# EAGLE design Light_V1.0 (EAGLE 9.4.1)
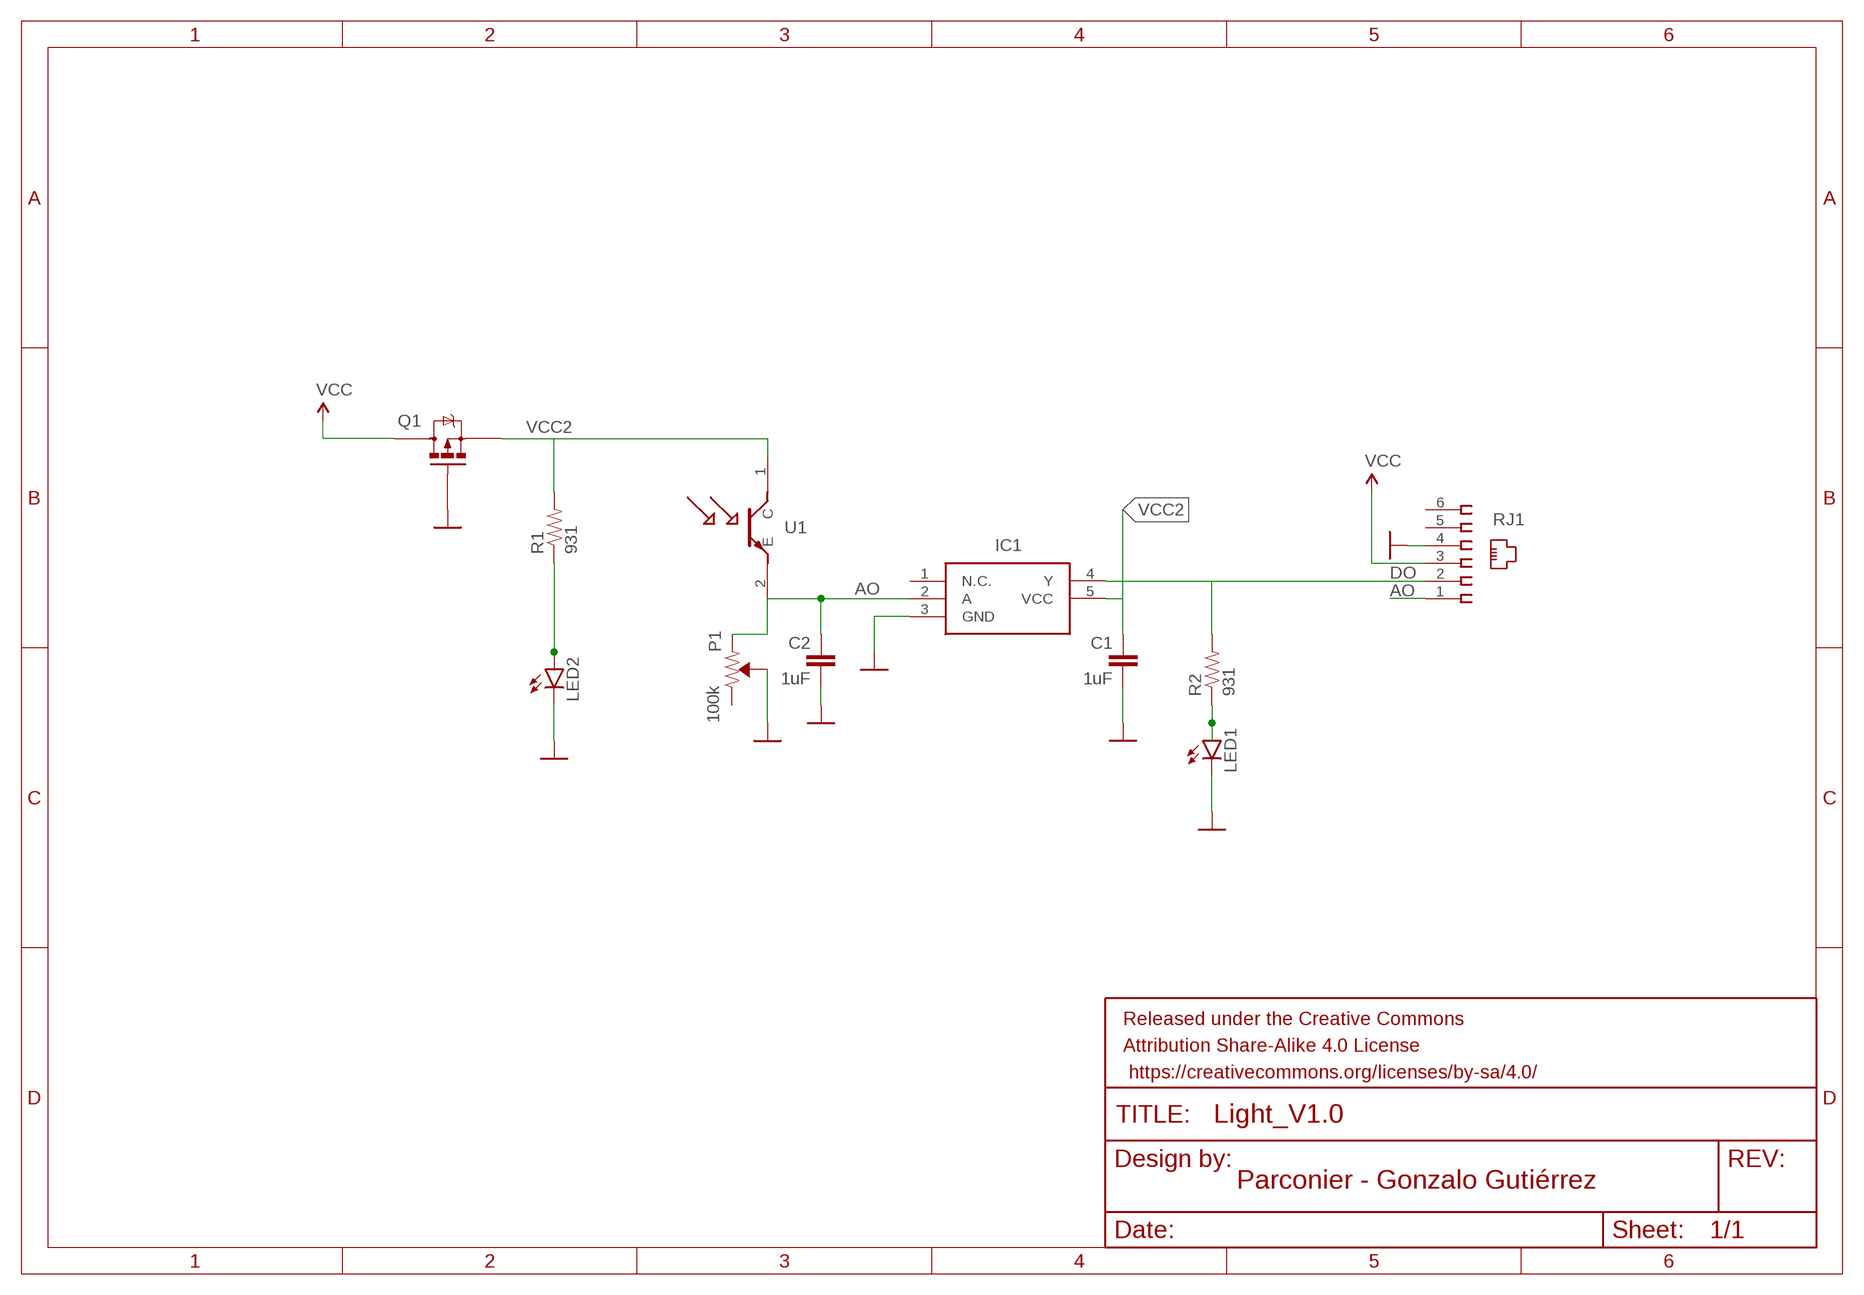
[diagram p0: schematic, sheet 1]

## Parts
C1  1uF  CAP_0402  [0402]
C2  1uF  CAP_0402  [0402]
IC1  74LVC1G14GW-Q100,1  [SOT65P212X110-5N]
LED1  LED0603  [LED-0603]
LED2  LED0603  [LED-0603]
P1  100k  TRIMPOT  [3309W-1-104]
Q1  RU1C002ZPTCL  [SOTFL65P210X105-3N]
R1  931  RES_0402  [RESC1005X35]
R2  931  RES_0402  [RESC1005X35]
RJ1  615006138421  [615006138421]
U1  NJL7302L-F3  [NJL7302L-F3]

## Nets
AO: C2.1 IC1.2(A) P1.1(CCW) RJ1.1 U1.2(E)
DO: IC1.4(Y) R2.2 RJ1.2
GND: C1.2 C2.2 IC1.3(GND) LED1.C LED2.C P1.2(WIPER) Q1.1(G) RJ1.4
N$9: LED1.A R2.1
N$10: LED2.A R1.1
VCC: Q1.3(D) RJ1.3
VCC2: C1.1 IC1.5(VCC) Q1.2(S) R1.2 U1.1(C)
Unconnected: IC1.1(N.C.) P1.3(CW) RJ1.5 RJ1.6

## Library data of the parts
C1 C2 = Perfect_0402:CAP_0402: 0402 (1005 Metric) Nick Garner - TeleSense; MPN: CC0402ZRY5V6BB105
IC1 = 74LVC1G14GW-Q100_1:74LVC1G14GW-Q100,1: Inverter SchmittTrigger CMOS Auto TSSOP5 Source: Datasheet <https://assets.nexperia.com/documents/data-sheet/74LVC1G14_Q100.pdf>; ARROW_PART_NUMBER: 74LVC1G14GW-Q100,1; ARROW_PRICE/STOCK: https://www.arrow.com/en/products/74lvc1g14gw-q1001/nexperia; DESCRIPTION: Inverter SchmittTrigger CMOS Auto TSSOP5; HEIGHT: 1.1mm; MANUFACTURER_NAME: Nexperia; MANUFACTURER_PART_NUMBER: 74LVC1G14GW-Q100,1; MPN: 74AHC1G14GW-Q100,1; RS_PART_NUMBER: 1526474; RS_PRICE/STOCK: http://befr.rs-online.com/web/p/products/1526474
LED1 = SparkFun-LED:LED: LEDs Standard schematic elements and footprints for 5mm, 3mm, 1206, and 0603 sized LEDs. 5mm - Spark Fun Electronics SKU : COM-00529 (and others); MPN: LB Q39E-L2OO-35-1
LED2 = SparkFun-LED:LED: LEDs Standard schematic elements and footprints for 5mm, 3mm, 1206, and 0603 sized LEDs. 5mm - Spark Fun Electronics SKU : COM-00529 (and others); MPN: LTST-C193KRKT-5A
P1 = SparkFun-Resistors_2:TRIMPOT: Trimming Potentiometer (Trimpot) Three-terminal potentiometers, with an adjustable wiper and two adjustable resistors. A pot can be used to create a configurable voltage divider, or as a variable resistor. "Trimpots" are a subset of potentiometers, usually intended for "set-and-forget" applications. They're often more delicate than standard potentiometers - rated for fewer turns. Variants PTH-KNOB - PTH Trimpot w/ finger-adjustable knob Trimpot 10K with Knob <https://www.sparkfun.com/products/9806> (COM-09806) Datasheet <http://www.sparkfun.com/datasheets/Components/General/TSR-3386.pdf> SMD-3MM-CLOSED-FRAME - SMD 3mm Square Closed-Frame Trimpot Used on e.g. EasyDriver - Stepper Motor Driver <https://www.sparkfun.com/products/12779> Datasheet <http://www.bitechnologies.com/pdfs/22.pdf> (22AR10KTR) SMD-5MM - SMD 5mm Square Closed-Frame Trimpot Used on e.g. IOIO-OTG - V2.2 <https://www.sparkfun.com/products/13613> Datasheet <http://www.vishay.com/docs/51008/ts53.pdf> (TS53YL502MR10) SMD-3MM-1/10W-25% - 3mm Square Open-Frame Trimpot Used on e.g. SparkFun Shapeoko <https://www.sparkfun.com/products/13899> Datasheet <http://www.bourns.com/docs/Product-Datasheets/TC33.pdf> (TC33X-2-103E); MPN: 3309W-1-104; MPNCH: 065-100K
Q1 = RU1C002ZPTCL:RU1C002ZPTCL: ROHM - RU1C002ZPTCL - MOSFET, P-CH, -20V, -0.2A, SOT-323FL Source: Datasheet <https://componentsearchengine.com/Datasheets/2/RU1C002ZPTCL.pdf>; ARROW_PART_NUMBER: RU1C002ZPTCL; DESCRIPTION: ROHM - RU1C002ZPTCL - MOSFET, P-CH, -20V, -0.2A, SOT-323FL; HEIGHT: 1.05mm; MANUFACTURER_NAME: ROHM Semiconductor; MANUFACTURER_PART_NUMBER: RU1C002ZPTCL; MPN: RU1C002ZPTCL; SPICEPREFIX: Q
R1 R2 = Perfect_0402:RES_0402; MPN: RC0402FR-07931RL
RJ1 = 615006138421:615006138421: HORIZONTAL PLASTIC 6P6C MODULAR JACK TAP UP Source: Datasheet <http://docs-europe.electrocomponents.com/webdocs/0f88/0900766b80f88670.pdf>; DESCRIPTION: HORIZONTAL PLASTIC 6P6C MODULAR JACK TAP UP; HEIGHT: mm; MANUFACTURER_NAME: W&uuml;rth Elektronik; MANUFACTURER_PART_NUMBER: 615006138421; MPN: 54601-906WPLF; RS_PART_NUMBER: 7350282; SUPPLIER_NAME: RS
U1 = EAALST05RDMA0:NJL7302L-F3; MPN: NJL7302L-F3

## Board
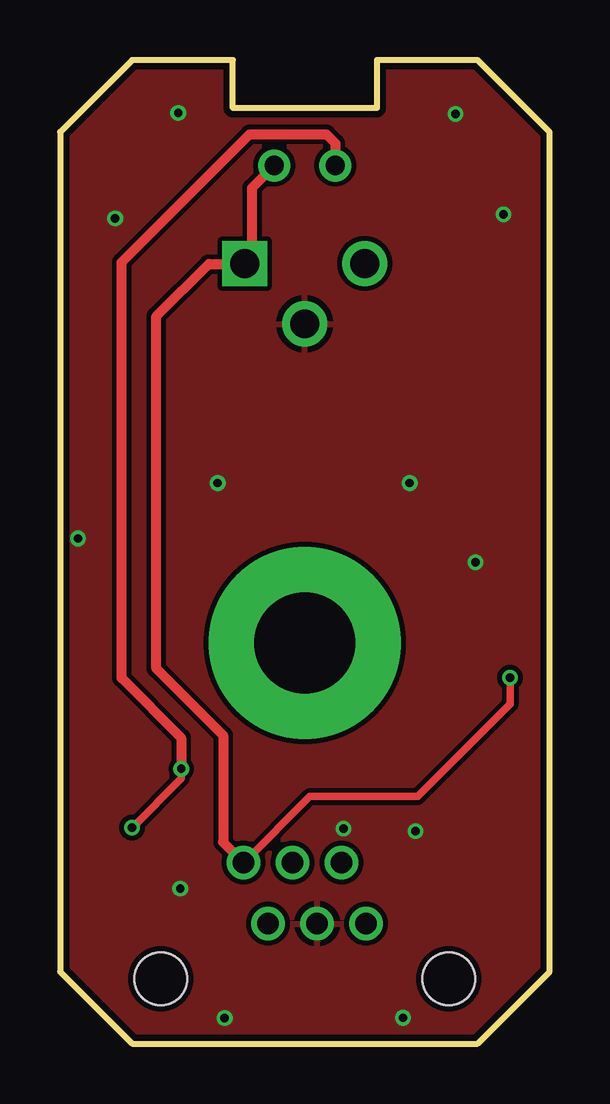
[diagram p1: board, top side]
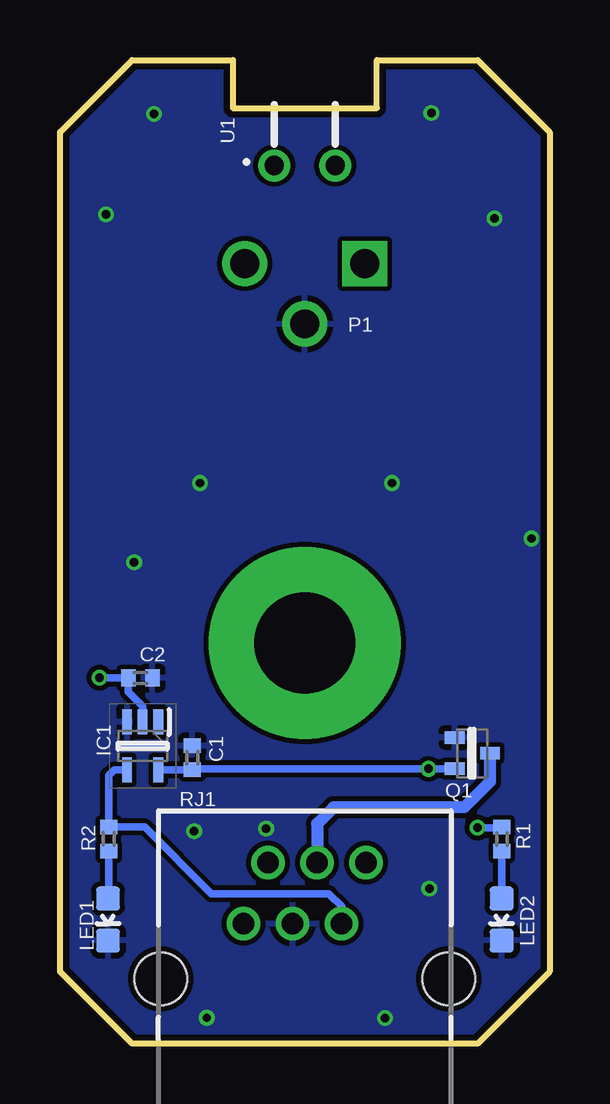
[diagram p2: board, bottom side, seen from below]

Size 20.4 x 41 mm. Coordinates in mm from the lower left corner, seen from the top.
Outline: 0,38 0,3 3,0 17.4,0 20.4,3 20.4,38 17.4,41 13.2,41 13.2,39 7.2,39 7.2,41 3,41 0,38
Copper layers (1*16): Top 0.035mm / dielectric 1.5mm / Bottom 0.035mm
Design rules "SeeedStudio_2layer_DRU_no_angle_20140221": minimum track width 6mil, minimum drill 12mil, track to track 6mil, track to pad 6mil, pad to pad 6mil, via to via 6mil, smd to smd 0mil, copper to edge 10mil, drill to drill 10mil, minimum pad ring 10mil, minimum via ring 6mil, stop-mask expansion 2mil, vias tented up to drill 100mil, thermal gap 10mil

### Footprints (pad centres in the part's own frame; a part is rotated, then mirrored left to right if it is on the bottom)
0402 = smd 0.6 x 0.7: 1 -0.5,0; 2 0.5,0
SOT65P212X110-5N = smd 1.05 x 0.4: 1 -1,0.65; 2 -1,0; 3 -1,-0.65; 4 1,-0.65; 5 1,0.65
LED-0603 = smd 1 x 1: A 0,-0.877; C 0,0.877
3309W-1-104 = drill 1.2 pad 1.88 square: 1 -2.5,-0.015 | drill 1.2 pad 1.88: 2 0,2.5; 3 2.5,-0.015
SOTFL65P210X105-3N = smd 0.83 x 0.52: 1 -0.735,0.65; 2 -0.735,-0.65; 3 0.735,0
RESC1005X35 = smd 0.6 x 0.7: 1 -0.5,0; 2 0.5,0
615006138421 = drill 0.9 pad 1.4: 1 2.55,4.84; 2 1.53,2.3; 3 0.51,4.84; 4 -0.51,2.3; 5 -1.53,4.84; 6 -2.55,2.3 | hole 2.2: -6,0; 6,0
NJL7302L-F3 = drill 0.8 pad 1.34: 1 -1.27,0; 2 1.27,0

### Placement (x,y rotation side)
C1  14.89,11.91 90 bottom
C2  17.05,15.24 0 bottom
IC1  16.96,12.4 270 bottom
LED1  18.4,5.17 180 bottom
LED2  2,5.17 180 bottom
P1  10.2,32.5 180 bottom
Q1  3.22,12.1 0 bottom
R1  1.99,8.52 90 bottom
R2  18.37,8.53 90 bottom
RJ1  10.2,2.7 0 bottom
U1  10.2,36.6 0 bottom

### Tracks (layer width: path | path; a pad name or v marks a point on that pad's centre or on a via)
AO  (via drill 0.35)
  Top 0.305: RJ1.1 10.41,10.3 14.9,10.3 18.75,14.15 v18.75,15.25
  Top 0.406: RJ1.1 6.8,8.39 6.8,12.85 4.01,15.63 4.01,30.32 6.2,32.5 7.68,32.5 P1.1 8,32.81 8,35.67 U1.2
  Bottom 0.305: v18.75,15.25 C2.1 17.55,14.65 16.96,14.06 IC1.2
DO
  Bottom 0.305: IC1.4 18.15,11.4 18.37,11.18 R2.2 16.88,9.03 14.1,6.25 9.2,6.25 8.67,5.72 RJ1.2
GND  (via drill 0.35)
  other vias: 6.86,1.06 14.29,1.07 2.3,34.4 16.48,38.75 4.93,38.8 6.57,23.37 18.48,34.56 0.76,21.05 17.31,20.06 14.57,23.37 11.81,8.96 14.81,8.86 5.01,6.46
  pour Top (isolate 0.2): 20.4,41 0,41 0,0 20.4,0
  pour Bottom (isolate 0.2): 20.4,0 0,0 0,41 20.4,41
N$9
  Bottom 0.305: LED1.A 18.37,6.08 R2.1
N$10
  Bottom 0.305: LED2.A 2,8.01 R1.1
N$11  (via drill 4.2 pad 8)
  other vias: 10.2,16.7
VCC
  Bottom 0.508: Q1.3 2.48,10.92 3.55,9.85 9,9.85 9.69,9.16 RJ1.3
VCC2  (via drill 0.35)
  Top 0.305: v3,9 5.05,11.05 v5.05,11.45
  Top 0.406: v5.05,11.45 5.05,12.75 2.56,15.23 2.56,31 2.56,31.43 2.56,32.56 7.9,37.9 11.1,37.9 11.47,37.53 U1.1
  Bottom 0.305: R1.2 2.01,9 v3,9 | Q1.2 v5.05,11.45 14.86,11.45 C1.1 14.9,11.4 IC1.5